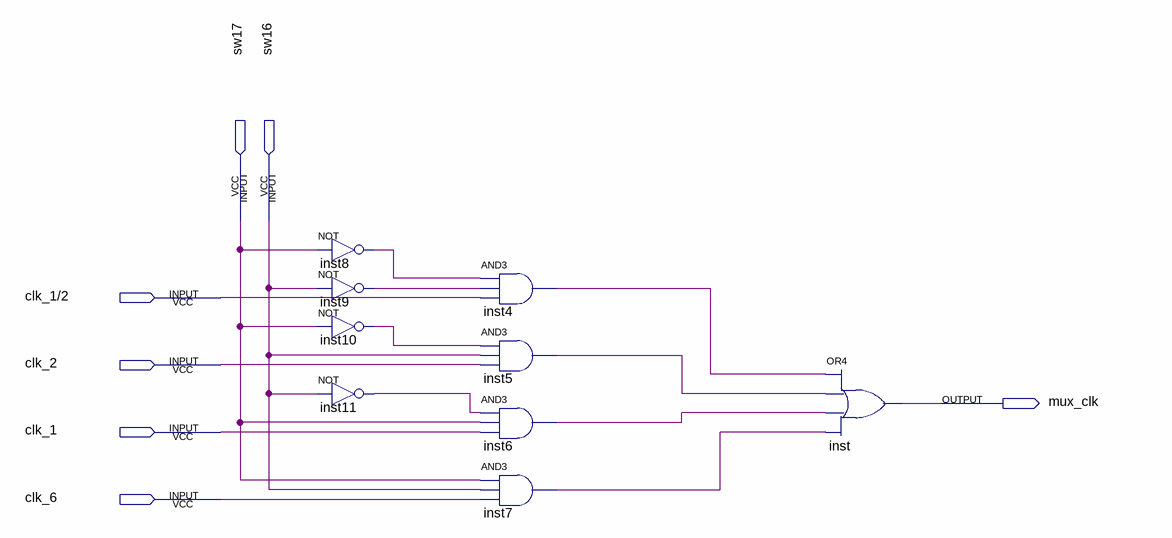
[diagram p0: schematic sheet]
// Quartus schematic mux.bdf as structural Verilog: 9 symbols, 7 pins
module mux (
  input  sw17,
  input  sw16,
  input  \clk_1/2 ,
  input  clk_2,
  input  clk_1,
  input  clk_6,
  output mux_clk
);

  wire inst4_out, inst5_out, inst6_out, inst7_out, inst8_out, inst9_out, inst10_out, inst11_out;

  not inst8 (inst8_out, sw17);
  not inst9 (inst9_out, sw16);
  not inst10 (inst10_out, sw17);
  not inst11 (inst11_out, sw16);
  and inst4 (inst4_out, inst8_out, inst9_out, \clk_1/2 );
  and inst5 (inst5_out, inst10_out, sw16, clk_2);
  and inst6 (inst6_out, inst11_out, sw17, clk_1);
  and inst7 (inst7_out, sw17, sw16, clk_6);
  or inst (mux_clk, inst4_out, inst5_out, inst6_out, inst7_out);
endmodule
